# Altium project 4Z_PCB_2.PrjPcb
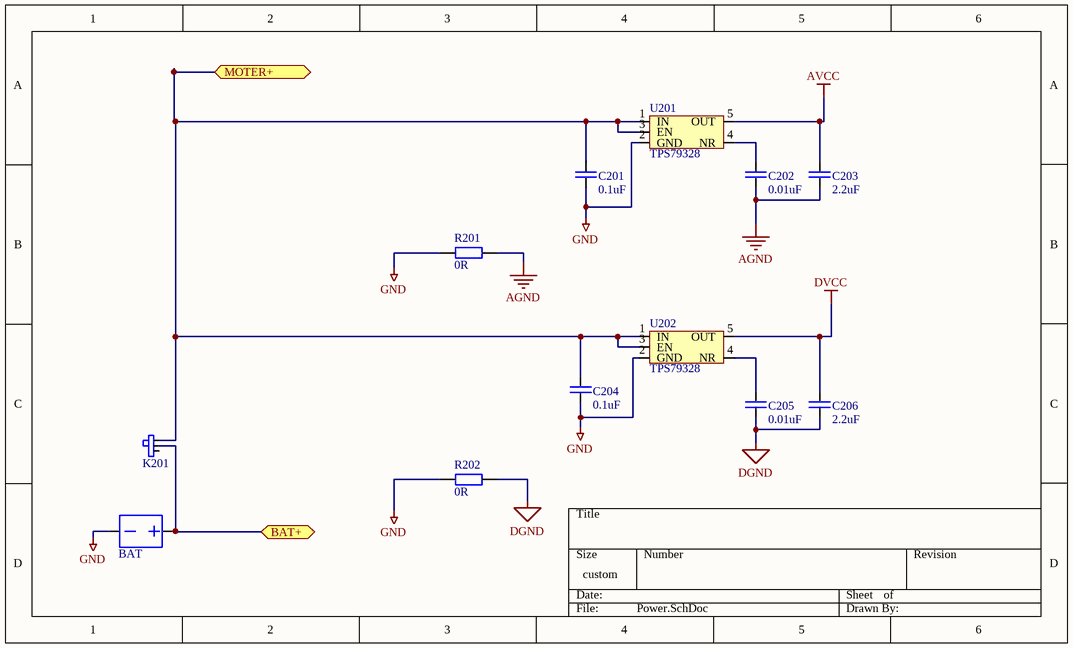
[diagram p0: Power.SchDoc]
1 sheet, 12 parts. Net scope: flat (ports and power ports of the same name join across sheets).
Board files: 4Z_PCB_2.PcbDoc, PCB3.0.PcbDoc

## Sheet Power.SchDoc
size 199 x 119 mm

### Parts
BAT  BAT  [XH254]  (value not drawn)
C201  0.1uF  [0603]
C202  0.01uF  [0603]
C203  2.2uF  [0603]
C204  0.1uF  [0603]
C205  0.01uF  [0603]
C206  2.2uF  [0603]
K201  32开关  [32k]  (value not drawn)
R201  0R  [0603]
R202  0R  [0603]
U201  TPS79328  [TPS793xx]
U202  TPS79328  [TPS793xx]

### Ports
BAT+, MOTER+

### Nets
AGND: C202.1 C203.1 R201.1
AVCC: C203.2 U201.5(OUT)
DGND: C205.1 C206.1 R202.1
DVCC: C206.2 U202.5(OUT)
GND: BAT.1 C201.1 C204.1 R201.2 R202.2 U201.2(GND) U202.2(GND)
NetBAT_2: BAT.2 K201.2 ; port BAT+
NetC201_2: C201.2 C204.2 K201.1 U201.1(IN) U201.3(EN) U202.1(IN) U202.3(EN) ; port MOTER+
NetC202_2: C202.2 U201.4(NR)
NetC205_2: C205.2 U202.4(NR)

Not connected (* = marked no-connect by the designer): K201 3

### Library data of the parts
C201-C206 = C0603
R201 R202 = R0603
U201 U202 = TPS793xx